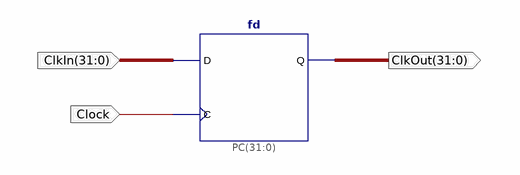
[diagram p0: schematic sheet 1]
// Xilinx ISE schematic pc.sch (xa9500xl) as structural Verilog: 1 symbols, 3 ports
module pc (
  input  [31:0] ClkIn,
  input  Clock,
  output [31:0] ClkOut
);

  fd PC[31:0] (.C(Clock), .D(ClkIn), .Q(ClkOut));
endmodule
